# EAGLE schematic voltage_sensor_v0.4 (EAGLE 9.6.2)
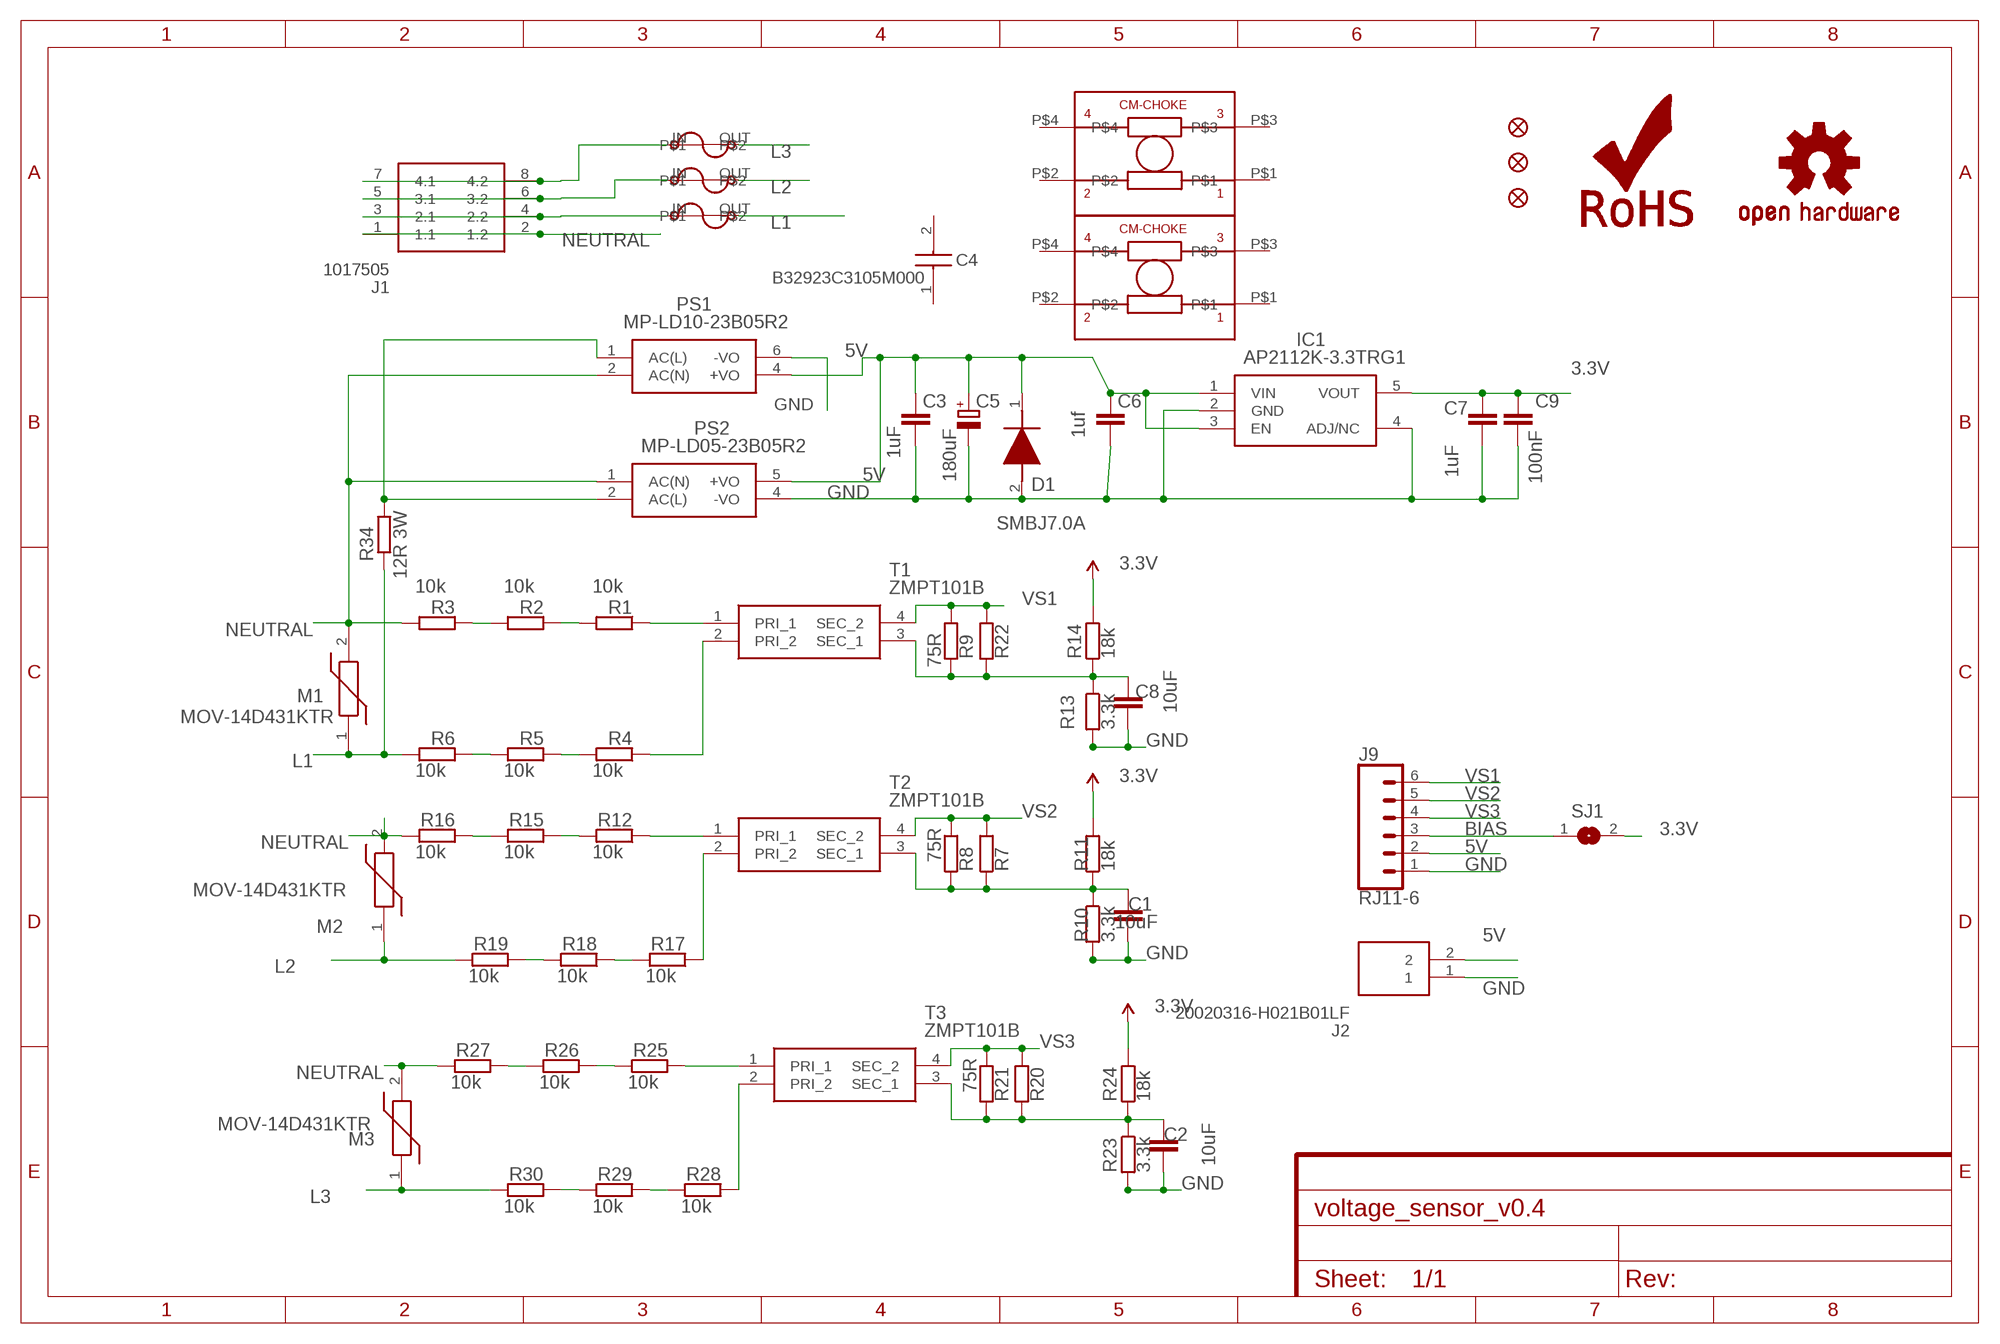
[diagram p0: schematic, sheet 1]

## Parts
C1  10uF  C-EUC0603  [C0603]
C2  10uF  C-EUC0603  [C0603]
C3  1uF  C-EUC0603  [C0603]
C4  B32923C3105M000  [B32923C_(26.5_X_12)]
C5  180uF  CPOL-EUC  [PANASONIC_C]
C6  1uf  C-EUC0603  [C0603]
C7  1uF  C-EUC0603  [C0603]
C8  10uF  C-EUC0603  [C0603]
C9  100nF  C-EUC0603  [C0603]
D1  SMBJ7.0A  [DIOM5336X244N]
F1  2A/250V  BEL1AFUSE  [BELFUSE1A]
F2  2A/250V  BEL1AFUSE  [BELFUSE1A]
F3  2A/250V  BEL1AFUSE  [BELFUSE1A]
FD1  FIDUCIAL1X2  [FIDUCIAL-1X2]
FD2  FIDUCIAL1X2  [FIDUCIAL-1X2]
FD3  FIDUCIAL1X2  [FIDUCIAL-1X2]
IC1  AP2112K-3.3TRG1  [SOT95P282X130-5N]
J1  1017505  [1017505]
J2  20020316-H021B01LF  [20020316H021B01LF]
J9  RJ11-6  [RJ11-6]
LOGO1  ROHS_LOGO  [ROHS_LOGO_0.18_IN]
LOGO2  OSHW-LOGOS-COPPER  [OSHW-LOGO-S_COPPER]
M1  MOV-14D431KTR  [MOV14D431KTR]
M2  MOV-14D431KTR  [MOV14D431KTR]
M3  MOV-14D431KTR  [MOV14D431KTR]
PS1  MP-LD10-23B05R2  MP-LD10-23B12R2  [MPLD1023B12R2]
PS2  MP-LD05-23B05R2  MP-LD05-23B03R2  [MPLD0523B03R2]
R1  10k  R-EU_R0603  [R0603]
R2  10k  R-EU_R0603  [R0603]
R3  10k  R-EU_R0603  [R0603]
R4  10k  R-EU_R0603  [R0603]
R5  10k  R-EU_R0603  [R0603]
R6  10k  R-EU_R0603  [R0603]
R7  R-EU_0204/7  [0204/7]
R8  75R  R-EU_R0603  [R0603]
R9  75R  R-EU_R0603  [R0603]
R10  3.3k  R-EU_R0603  [R0603]
R11  18k  R-EU_R0603  [R0603]
R12  10k  R-EU_R0603  [R0603]
R13  3.3k  R-EU_R0603  [R0603]
R14  18k  R-EU_R0603  [R0603]
R15  10k  R-EU_R0603  [R0603]
R16  10k  R-EU_R0603  [R0603]
R17  10k  R-EU_R0603  [R0603]
R18  10k  R-EU_R0603  [R0603]
R19  10k  R-EU_R0603  [R0603]
R20  R-EU_0204/7  [0204/7]
R21  75R  R-EU_R0603  [R0603]
R22  R-EU_0204/7  [0204/7]
R23  3.3k  R-EU_R0603  [R0603]
R24  18k  R-EU_R0603  [R0603]
R25  10k  R-EU_R0603  [R0603]
R26  10k  R-EU_R0603  [R0603]
R27  10k  R-EU_R0603  [R0603]
R28  10k  R-EU_R0603  [R0603]
R29  10k  R-EU_R0603  [R0603]
R30  10k  R-EU_R0603  [R0603]
R34  12R 3W  R-EU_R2512  [R2512]
SJ1  SJ  [SJ]
T1  ZMPT101B  [ZMPT101B]
T2  ZMPT101B  [ZMPT101B]
T3  ZMPT101B  [ZMPT101B]
U$1  47mH  RN114-0.3-02-47M  [RN114-0.3-02-47M]
U$2  RN214-0.3-02-47M  [RN214-0.3-02-47M]

## Nets
3.3V: C7.1 C9.1 IC1.5(VOUT) R11.2 R14.2 R24.2 SJ1.2
5V: C3.1 C5.+ C6.1 D1.1(K) IC1.1(VIN) IC1.3(EN) J2.2 J9.2 PS1.4(+VO) PS2.5(+VO)
BIAS: J9.3 SJ1.1
GND: C1.2 C2.2 C3.2 C5.- C6.2 C7.2 C8.2 C9.2 D1.2(A) IC1.2(GND) IC1.4(ADJ/NC) J2.1 J9.1 PS1.6(-VO) PS2.4(-VO) R10.2 R13.2 R23.2
L1: F1.OUT M1.1 R6.2 R34.1
L2: F2.OUT M2.1 R19.2
L3: F3.OUT M3.1 R30.2
N$1: R1.1 T1.1(PRI_1)
N$2: R4.1 T1.2(PRI_2)
N$3: R1.2 R2.1
N$4: R4.2 R5.1
N$5: R5.2 R6.1
N$6: R2.2 R3.1
N$7: F1.IN J1.3(2.1) J1.4(2.2)
N$8: F2.IN J1.5(3.1) J1.6(3.2)
N$9: C1.1 R7.1 R8.1 R10.1 R11.1 T2.3(SEC_1)
N$10: R12.1 T2.1(PRI_1)
N$11: R17.1 T2.2(PRI_2)
N$12: R12.2 R15.1
N$13: R17.2 R18.1
N$14: R18.2 R19.1
N$15: R15.2 R16.1
N$16: F3.IN J1.7(4.1) J1.8(4.2)
N$17: PS1.1(AC(L)) PS2.2(AC(L)) R34.2
N$18: C2.1 R20.1 R21.1 R23.1 R24.1 T3.3(SEC_1)
N$19: R25.1 T3.1(PRI_1)
N$20: R28.1 T3.2(PRI_2)
N$21: R25.2 R26.1
N$22: R28.2 R29.1
N$23: R29.2 R30.1
N$24: R26.2 R27.1
N$25: C8.1 R9.1 R13.1 R14.1 R22.1 T1.3(SEC_1)
NEUTRAL: J1.1(1.1) J1.2(1.2) M1.2 M2.2 M3.2 PS1.2(AC(N)) PS2.1(AC(N)) R3.2 R16.2 R27.2
VS1: J9.6 R9.2 R22.2 T1.4(SEC_2)
VS2: J9.5 R7.2 R8.2 T2.4(SEC_2)
VS3: J9.4 R20.2 R21.2 T3.4(SEC_2)
Unconnected: C4.1 C4.2 U$1.P$1 U$1.P$2 U$1.P$3 U$1.P$4 U$2.P$1 U$2.P$2 U$2.P$3 U$2.P$4

## Library data of the parts
C1-C3 C6-C9 = resistor:C-EU: CAPACITOR, European symbol
C4 = B32923C3105M000:B32923C3105M000: EPCOS - B32923C3105M000 - Safety Capacitor, 1 ?F, X2, B32923C Series, 305 V, Metallized PP Source: Datasheet <https://product.tdk.com/system/files/dam/doc/product/capacitor/film/emi/data_sheet/20/20/db/fc_2009/x2_b32921_928.pdf>; ARROW_PART_NUMBER: B32923C3105M000; ARROW_PRICE-STOCK: https://www.arrow.com/en/products/b32923c3105m000/epcos-tdk; DESCRIPTION: EPCOS - B32923C3105M000 - Safety Capacitor, 1 ?F, X2, B32923C Series, 305 V, Metallized PP; HEIGHT: mm; MANUFACTURER_NAME: TDK; MANUFACTURER_PART_NUMBER: B32923C3105M000
C5 = rcl:CPOL-EU: POLARIZED CAPACITOR, European symbol; SPICEPREFIX: C
D1 = SMBJ7.0A:SMBJ7.0A: TVS, SMD, 600W, 7V HY Electronic Corp SMBJ7.0A Uni-Directional TVS Diode, 600 (Min.)W peak, 2-Pin SMB Source: Datasheet; DESCRIPTION: TVS, SMD, 600W, 7V HY Electronic Corp SMBJ7.0A Uni-Directional TVS Diode, 600 (Min.)W peak, 2-Pin SMB; HEIGHT: 2.44mm; MANUFACTURER_NAME: HY Electronic Corp; MANUFACTURER_PART_NUMBER: SMBJ7.0A
F1-F3 = Qxd:BEL1AFUSE
FD1-FD3 = SparkFun-Aesthetics:FIDUCIAL: Fiducial Alignment Points Point-of-reference for pick-and-place machines and other optical instruments.
IC1 = AP2112K-3.3TRG1:AP2112K-3.3TRG1: 600mA 3.3V LDO Regulator Enable SOT23-5 DiodesZetex AP2112K-3.3TRG1, LDO Voltage Regulator, 3.3 V +/-1.5%, 2.5 6 Vin, 5-Pin SOT-23 Source: Datasheet <http://uk.rs-online.com/web/p/products/8283509>; ARROW_PART_NUMBER: AP2112K-3.3TRG1; ARROW_PRICE-STOCK: https://www.arrow.com/en/products/ap2112k-3.3trg1/diodes-incorporated?region=nac; DESCRIPTION: 600mA 3.3V LDO Regulator Enable SOT23-5 DiodesZetex AP2112K-3.3TRG1, LDO Voltage Regulator, 3.3 V +/-1.5%, 2.5 6 Vin, 5-Pin SOT-23; HEIGHT: 1.3mm; MANUFACTURER_NAME: Diodes Inc.; MANUFACTURER_PART_NUMBER: AP2112K-3.3TRG1; MOUSER_PART_NUMBER: 621-AP2112K-3.3TRG1; MOUSER_PRICE-STOCK: https://www.mouser.co.uk/ProductDetail/Diodes-Incorporated/AP2112K-33TRG1?qs=x6A8l6qLYDDPYHosCdzh%2FA%3D%3D
J1 = 1017505:1017505: PCB terminal block, nominal current: 32 A, rated voltage (III/2): 400 V, nominal cross section: 2.5 mm?, Number of potentials: 4, Number of rows: 1, Number of positions per row: 4, product range: TDPT 2,5/..-SP, pitch: 5.08 mm, connection method: Push-in spring connection, mounting: Wave soldering, conductor/PCB connection direction: 0 ?, color: green, Pin layout: Linear double pinning, Solder pin [P]: 3.5 mm, type of packaging: packed in cardboard Source: Datasheet <http://www.phoenixcontact.com/de/produkte/1017505/pdf>; ARROW_PART_NUMBER: 1017505; ARROW_PRICE-STOCK: https://www.arrow.com/en/products/1017505/phoenix-contact; DESCRIPTION: PCB terminal block, nominal current: 32 A, rated voltage (III/2): 400 V, nominal cross section: 2.5 mm?, Number of potentials: 4, Number of rows: 1, Number of positions per row: 4, product range: TDPT 2,5/..-SP, pitch: 5.08 mm, connection method: Push-in spring connection, mounting: Wave soldering, conductor/PCB connection direction: 0 ?, color: green, Pin layout: Linear double pinning, Solder pin [P]: 3.5 mm, type of packaging: packed in cardboard; HEIGHT: 19.2mm; MANUFACTURER_NAME: Phoenix Contact; MANUFACTURER_PART_NUMBER: 1017505; MOUSER_PART_NUMBER: 651-1017505; MOUSER_PRICE-STOCK: https://www.mouser.co.uk/ProductDetail/Phoenix-Contact/1017505?qs=F5EMLAvA7IDSv5uM7A6HhA%3D%3D
J2 = 20020316-H021B01LF:20020316-H021B01LF: Conn Pluggable Terminal Block 2 POS 5.08mm Screw RA Thru-Hole 16A/Contact Box Source: Datasheet <https://datasheet.datasheetarchive.com/originals/distributors/Datasheets-DGA18/1074774.pdf>; ARROW_PART_NUMBER: 20020316-H021B01LF; ARROW_PRICE-STOCK: https://www.arrow.com/en/products/20020316-h021b01lf/amphenol; DESCRIPTION: Conn Pluggable Terminal Block 2 POS 5.08mm Screw RA Thru-Hole 16A/Contact Box; HEIGHT: 13.8mm; MANUFACTURER_NAME: Amphenol; MANUFACTURER_PART_NUMBER: 20020316-H021B01LF; MOUSER_PART_NUMBER: N/A; MOUSER_PRICE-STOCK: https://www.mouser.co.uk/ProductDetail/Amphenol/20020316-H021B01LF?qs=W0yvOO0ixfFlV4eKhSWD3Q%3D%3D
J9 = SparkFun-Connectors:RJ11-6: RJ11 Jack - 6 pin Commonly found on CAT3 devices and some Microchip programmers. Here is the connector we sell at SparkFun: RJ11 6-Pin Connector <https://www.sparkfun.com/products/132> (PRT-00132) Datasheet <http://www.sparkfun.com/datasheets/Prototyping/Connectors/RJ11-Datasheet.pdf> It is used on this SparkFun product: SparkFun Weather Shield <https://www.sparkfun.com/products/12081> (DEV-12081) Weather Meters <https://www.sparkfun.com/products/8942> (SEN-08942); PROD_ID: CONN-08590; SF_ID: PRT-00132; VALUE: RJ11
LOGO1 = SparkFun-Aesthetics:ROHS_LOGO: Restriction of Hazardous Substances (RoHS) Logo Logo for RoHS-certified hardware.
LOGO2 = SparkFun-Aesthetics:OSHW-LOGO: Open-Source Hardware (OSHW) Logo This logo indicates the piece of hardware it is found on incorporates a OSHW license and/or adheres to the definition of open source hardware found here: http://freedomdefined.org/OSHW
M1-M3 = MOV-14D431KTR:MOV-14D431KTR: Var MOV 275VAC/350VDC 4500A 430V Thru-Hole Radial T/R Source: Datasheet <https://componentsearchengine.com/Datasheets/2/MOV-14D431KTR.pdf>; ARROW_PART_NUMBER: MOV-14D431KTR; ARROW_PRICE-STOCK: https://www.arrow.com/en/products/mov-14d431ktr/bourns; DESCRIPTION: Var MOV 275VAC/350VDC 4500A 430V Thru-Hole Radial T/R; HEIGHT: 20mm; MANUFACTURER_NAME: Bourns; MANUFACTURER_PART_NUMBER: MOV-14D431KTR; MOUSER_PART_NUMBER: 652-MOV-14D431KTR; MOUSER_PRICE-STOCK: https://www.mouser.co.uk/ProductDetail/Bourns/MOV-14D431KTR?qs=CQ3B1E%252BbPs0ZvUvqcBsPRw%3D%3D
PS1 = MP-LD10-23B12R2:MP-LD10-23B12R2: MULTICOMP PRO - MP-LD10-23B05R2 - AC/DC PCB Mount Power Supply (PSU), 100 to 430VDC, ITE, Household, Medical & Transformers, 5V Output Source: Datasheet <https://componentsearchengine.com/Datasheets/2/MP-LD10-23B05R2.pdf>; DESCRIPTION: MULTICOMP PRO - MP-LD10-23B12R2 - AC/DC PCB Mount Power Supply (PSU), 100 to 430VDC, ITE, Household, Medical & Transformers, 1 Output; HEIGHT: 21.5mm; MANUFACTURER_NAME: MULTICOMP; MANUFACTURER_PART_NUMBER: MP-LD10-23B05R2
PS2 = MP-LD05-23B03R2:MP-LD05-23B03R2: POWER SUPPLY, AC-DC, 3.3V, 1.515A Source: Datasheet <https://www.farnell.com/datasheets/3167202.pdf>; DESCRIPTION: POWER SUPPLY, AC-DC, 3.3V, 1.515A; HEIGHT: 18.1mm; MANUFACTURER_NAME: MULTICOMP; MANUFACTURER_PART_NUMBER: MP-LD05-23B03R2
R1-R30 = rcl:R-EU_: RESISTOR, European symbol
R34 = rcl:R-EU_: RESISTOR, European symbol; SPICEPREFIX: R
SJ1 = jumper:SJ: SMD solder JUMPER
T1-T3 = ZMPT101B:ZMPT101B: Current-type Voltage Transformer Source: Datasheet; DESCRIPTION: Current-type Voltage Transformer; HEIGHT: 18.8mm; MANUFACTURER_NAME: Qingxian Zeming Langxi Electronic; MANUFACTURER_PART_NUMBER: ZMPT101B
U$1 = Schaffner-CM-Choke:RN114-0.3-02-47M
U$2 = Schaffner-CM-Choke:RN214-0.3-02-47M

## Net classes
0 default: clearance 0.205 mm
1 power: width 0.305 mm, drill 0.6 mm, clearance 0.254 mm
2 gnd: width 0.254 mm, drill 0.6 mm, clearance 0.254 mm